# Altium project 1kW_BLDC_Controller.PrjPcb (part 1 of 2)
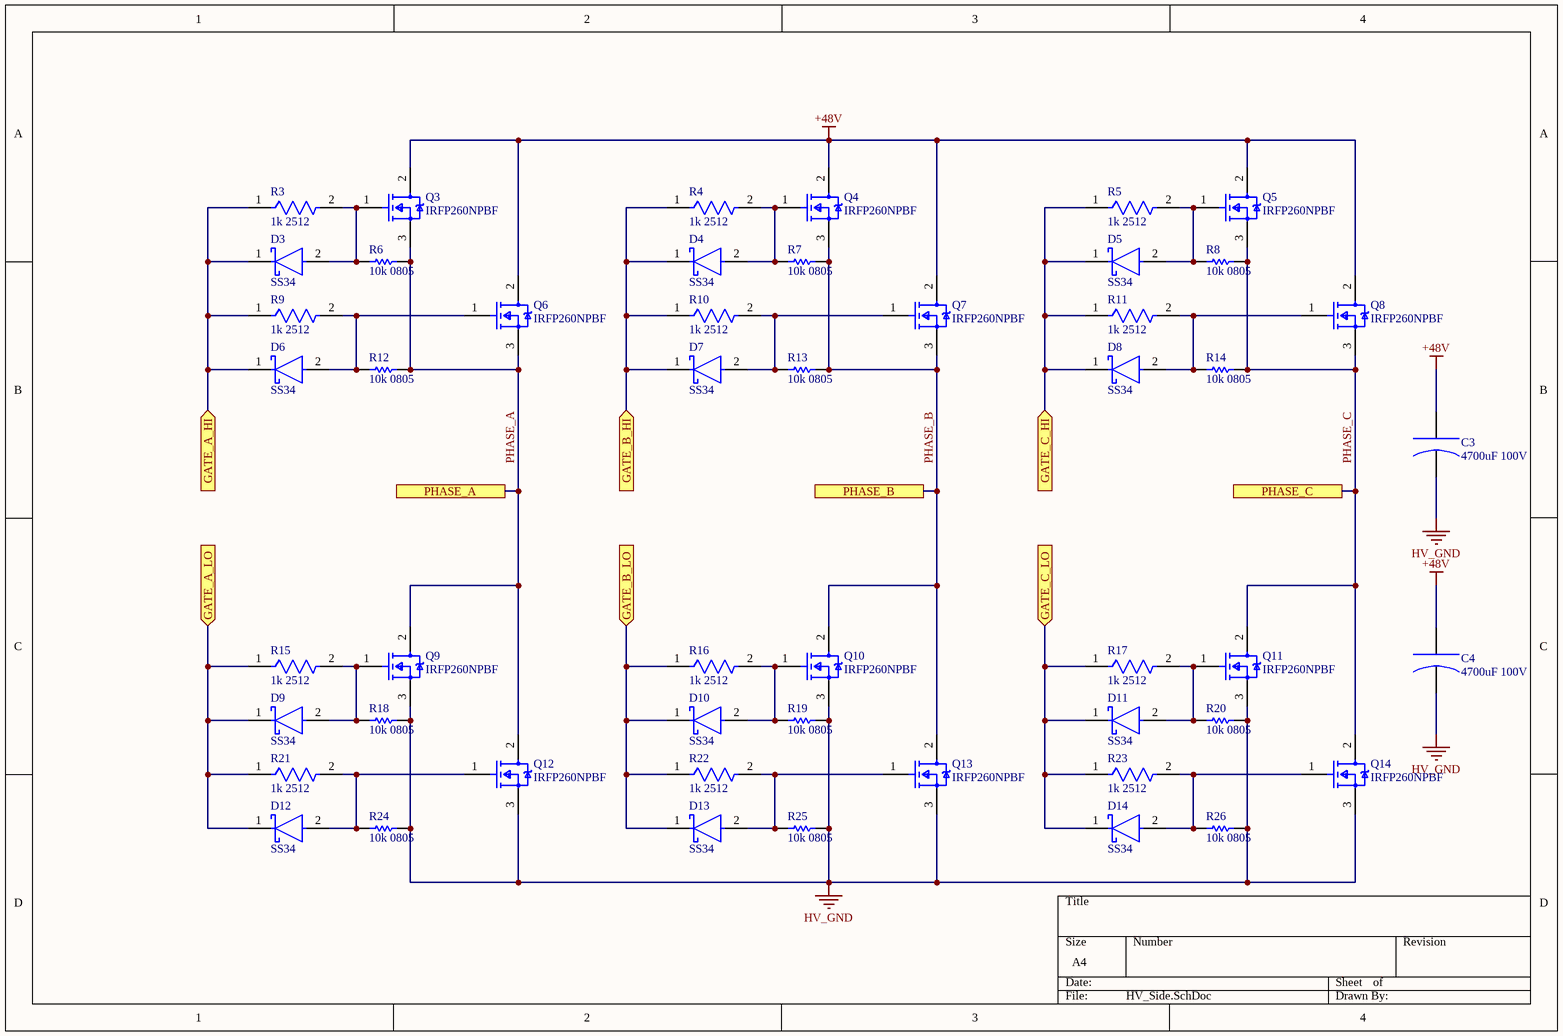
[diagram p0: HV_Side.SchDoc]
9 sheets, 236 parts. Net scope: global (net labels, ports and power ports of the same name join across sheets).
Board file: PCB1.PcbDoc
Sheets:
  HV_Side.SchDoc
  Gate_Driver.SchDoc
  Current_measurement.SchDoc
  Voltage_measurement.SchDoc
  Optocouplers.SchDoc
  optocouplers2.SchDoc
  Precharge circuit.SchDoc
  mcu.SchDoc
  stm32.SchDoc

## Sheet HV_Side.SchDoc
size A4; SheetNumber: 1; SheetTotal: 9

### Parts
C3  4700uF 100V  [4700uF 100V]
C4  4700uF 100V  [4700uF 100V]
D3  SS34  [DO-214AC]
D4  SS34  [DO-214AC]
D5  SS34  [DO-214AC]
D6  SS34  [DO-214AC]
D7  SS34  [DO-214AC]
D8  SS34  [DO-214AC]
D9  SS34  [DO-214AC]
D10  SS34  [DO-214AC]
D11  SS34  [DO-214AC]
D12  SS34  [DO-214AC]
D13  SS34  [DO-214AC]
D14  SS34  [DO-214AC]
Q3  IRFP260NPBF  [FP-PG-TO247-3-MFG]
Q4  IRFP260NPBF  [FP-PG-TO247-3-MFG]
Q5  IRFP260NPBF  [FP-PG-TO247-3-MFG]
Q6  IRFP260NPBF  [FP-PG-TO247-3-MFG]
Q7  IRFP260NPBF  [FP-PG-TO247-3-MFG]
Q8  IRFP260NPBF  [FP-PG-TO247-3-MFG]
Q9  IRFP260NPBF  [FP-PG-TO247-3-MFG]
Q10  IRFP260NPBF  [FP-PG-TO247-3-MFG]
Q11  IRFP260NPBF  [FP-PG-TO247-3-MFG]
Q12  IRFP260NPBF  [FP-PG-TO247-3-MFG]
Q13  IRFP260NPBF  [FP-PG-TO247-3-MFG]
Q14  IRFP260NPBF  [FP-PG-TO247-3-MFG]
R3  1k 2512  [R2512]
R4  1k 2512  [R2512]
R5  1k 2512  [R2512]
R6  10k 0805  [R0805]
R7  10k 0805  [R0805]
R8  10k 0805  [R0805]
R9  1k 2512  [R2512]
R10  1k 2512  [R2512]
R11  1k 2512  [R2512]
R12  10k 0805  [R0805]
R13  10k 0805  [R0805]
R14  10k 0805  [R0805]
R15  1k 2512  [R2512]
R16  1k 2512  [R2512]
R17  1k 2512  [R2512]
R18  10k 0805  [R0805]
R19  10k 0805  [R0805]
R20  10k 0805  [R0805]
R21  1k 2512  [R2512]
R22  1k 2512  [R2512]
R23  1k 2512  [R2512]
R24  10k 0805  [R0805]
R25  10k 0805  [R0805]
R26  10k 0805  [R0805]

### Ports
GATE_A_HI (in), GATE_A_LO (in), GATE_B_HI (in), GATE_B_LO (in), GATE_C_HI (in), GATE_C_LO (in), PHASE_A, PHASE_B, PHASE_C

### Nets
+48V: C3.1(+) C4.1(+) Q3.2(D) Q4.2(D) Q5.2(D) Q6.2(D) Q7.2(D) Q8.2(D)
HV_GND: C3.2(GND) C4.2(GND) Q9.3(S) Q10.3(S) Q11.3(S) Q12.3(S) Q13.3(S) Q14.3(S) R18.2 R19.2 R20.2 R24.2 R25.2 R26.2
PHASE_A: Q3.3(S) Q6.3(S) Q9.2(D) Q12.2(D) R6.2 R12.2 ; port PHASE_A
PHASE_B: Q4.3(S) Q7.3(S) Q10.2(D) Q13.2(D) R7.2 R13.2 ; port PHASE_B
PHASE_C: Q5.3(S) Q8.3(S) Q11.2(D) Q14.2(D) R8.2 R14.2 ; port PHASE_C
NetD3_1: D3.1(C) D6.1(C) R3.1 R9.1 ; port GATE_A_HI
NetD3_2: D3.2(A) Q3.1(G) R3.2 R6.1
NetD4_1: D4.1(C) D7.1(C) R4.1 R10.1 ; port GATE_B_HI
NetD4_2: D4.2(A) Q4.1(G) R4.2 R7.1
NetD5_1: D5.1(C) D8.1(C) R5.1 R11.1 ; port GATE_C_HI
NetD5_2: D5.2(A) Q5.1(G) R5.2 R8.1
NetD6_2: D6.2(A) Q6.1(G) R9.2 R12.1
NetD7_2: D7.2(A) Q7.1(G) R10.2 R13.1
NetD8_2: D8.2(A) Q8.1(G) R11.2 R14.1
NetD9_1: D9.1(C) D12.1(C) R15.1 R21.1 ; port GATE_A_LO
NetD9_2: D9.2(A) Q9.1(G) R15.2 R18.1
NetD10_1: D10.1(C) D13.1(C) R16.1 R22.1 ; port GATE_B_LO
NetD10_2: D10.2(A) Q10.1(G) R16.2 R19.1
NetD11_1: D11.1(C) D14.1(C) R17.1 R23.1 ; port GATE_C_LO
NetD11_2: D11.2(A) Q11.1(G) R17.2 R20.1
NetD12_2: D12.2(A) Q12.1(G) R21.2 R24.1
NetD13_2: D13.2(A) Q13.1(G) R22.2 R25.1
NetD14_2: D14.2(A) Q14.1(G) R23.2 R26.1

### Library data of the parts
C3 C4 = 4700uF 100V: 4700uF 100V Electrolytic Capacitor; Price per piece: 185; ComponentLink1Description: Product URL; ComponentLink1URL: https://sharvielectronics.com/product/4700uf-100v-electrolytic-capacitor/; ComponentLink2Description: Datasheet; ComponentLink2URL: *
D3-D14 = SS34: SS34 SMA 40V/3A Schottky Diode SMD Package-DO-214AC; Manufacturer: Vishay Semiconductors; Manufacturer Part Number: SS34-E3/57T; Max Repetitive Reverse Voltage: 40V; Max Junction Temp: +150°C; Forward Current: 3A; Peak Reverse Current: 0.5mA; Max Surge Forward Current: 100A; Standoff Height: 0mm; ComponentLink2Description: Datasheet; Device Class L3: Schottky Diodes; Height: 2.62mm; Lead Free: Yes; Package: 95402; Temperature Range High: +150°C; ComponentLink2URL: http://www.vishay.com/docs/88751/ss32.pdf; Temperature: -55°C to +150°C; Footprint Url: http://www.vishay.com/docs/95402/smc.pdf; Automotive: No; Category: Diode; RoHS: TRUE; Device Class L2: Diodes; Mouser Description: Schottky Diodes & Rectifiers 3.0 Amp 40 Volt; Octopart: https://octopart.com/ss34-e3%2F57t-vishay-39552907; Temperature Range Low: -55°C; Device Class L1: Discrete Semiconductors; Digikey Description: DIODE SCHOTTKY 40V 3A DO214AB; Price per piece: 5.75; Product URL: https://sharvielectronics.com/product/ss34-sma-40v-3a-schottky-diode-smd-package-do-214ac/; Datasheet: https://drive.google.com/file/d/1NCTjjzsUDglehHYd-VxKcrmaXziByLRA/view?usp=sharing
Q3-Q14 = CMP-32901-000262-1: MOSFET N-CH 200V 50A TO247AC; Drain to Source Resistance: 40mR; Turn-On Delay Time: 17ns; Gate to Source Voltage (Vgs): 20V; Turn-Off Delay Time: 55ns; Max Power Dissipation: 300W; Element Configuration: Single; Input Capacitance: 4.057nF; Threshold Voltage: 4V; Width: 0.209inch; Max Operating Temperature: 175°C; Number of Pins: 3; Lead Free: Lead Free; Rds On Max: 40mR; Case/Package: TO-247; Continuous Drain Current (ID): 50A; Power Dissipation: 300W; RoHS Compliant: Yes; Min Operating Temperature: -55°C; Drain to Source Voltage (Vdss): 200V; Mount: Through Hole; REACH SVHC: No SVHC; Packaging: Bulk; Drain to Source Breakdown Voltage: 200V; Halogen Free: Not Halogen Free; Height: 0.799inch; Length: 0.625inch; Max Dual Supply Voltage: 200V; Price per piece: 110.36
  Q6: ComponentLink1Description: Product URL; ComponentLink1URL: https://sharvielectronics.com/product/irfp260npbf-mosfet-200v-50a-n-channel-power-mosfet-to-247-package/; ComponentLink2Description: Datasheet; ComponentLink2URL: https://drive.google.com/file/d/1_dknK1hQ3iHxK7SVbMXCD2-SqB7tXl_1/view?usp=sharing
R3-R5 R9-R11 R15-R17 R21-R23 = 1K_2512: 1K Ohm 1W Resistor 2512 Package; Manufacturer: Vishay Dale; Manufacturer Part Number: CRCW25121R00FKEG; Resistance: 1R; Tolerance: 1%; Voltage Rating: 500V; Temperature Coefficient: 100ppm/°C; Prie per piece: 3.25; Number of Terminations: 2; Packaging: Tape and Reel; Features: Automotive AEC-Q200; Military Standard: Not; Power Rating: 1W; Max Operating Temperature: 155°C; Number of Pins: 2; Radiation Hardening: No; Mount: Surface Mount; Height: 0.6mm; Max Power Dissipation: 1W; Case Code (Metric): 6432; Termination: SMD/SMT; REACH SVHC: No SVHC; Case/Package: 2512; Weight: 0.001429oz; Package Quantity: 2000; Composition: Thick Film; Voltage Rating (DC): 500V; Width: 0.124inch; Length: 6.3mm; Lead Free: Lead Free; Min Operating Temperature: -55°C; Contact Plating: Tin; Case Code (Imperial): 2512; Depth: 3.15mm; Price per piece: 3.25; ComponentLink1Description: Product URL; ComponentLink1URL: https://sharvielectronics.com/product/1k-ohm-1w-resistor-2512-package-pack-of-5/; ComponentLink2Description: Datasheet; ComponentLink2URL: *; Product URL: https://sharvielectronics.com/product/1k-ohm-1w-resistor-2512-package-pack-of-5/; Datasheet: *
R6-R8 R12-R14 R18-R20 R24-R26 = 10k 0805: 10K Ohm 1/8 Watt Resistor 1% Tolerance RC0805FR-0710KL – 0805 Package; Price per piece: 0.82; Product URL: https://sharvielectronics.com/product/10k-ohm-1-8-watt-resistor-1-tolerance-rc0805fr-0710kl-0805-package/; Datasheet: https://drive.google.com/file/d/1pkLQT_RQ1i35oFQcGREpZr7Oy3Ppi-ZT/view?usp=sharing

## Sheet Gate_Driver.SchDoc
size A4; SheetNumber: 2; SheetTotal: 9; SPICEModelCacheSDNXEFHK: <root> / <DocumentId>SDNXEFHK</DocumentId> / <CacheFrame Number="0"> / <Model Name="jmk325ac6107_m-p" Kind="CKT"> / <Text>* JMK325AC6107_M-P     SPICE MODEL  ( General Type ) / *-------------------------------------------------------------------------------------------------------- / * Model Generated by TAIYO YUDEN Corporation (http://www.ty-top.com) / * Version 1.0 / * TAIYO YUDEN Control No. 180521 / *-------------------------------------------------------------------------------------------------------- / * / * Products Name : Multilayer Ceramic Capacitors / * / * Characteristics : / *     Capacitance : 100 uF , Rated Voltage : 6.3V , TCC : X6S / *     Case Size : 3.2 x 2.5 / 0.126 x 0.098 [mm/inch] , Thickness : 2.5 / 0.098 [mm/inch] / *     (Conditions: Temperature = 25 degC , DC Bias Current/Voltage = 0A / 0V) / * / * Frequency Range : 0.0001MHz - 3000MHz / * / * External Node Assignments : / * / *  1  o---| |---o  2 / * / *-------------------------------------------------------------------------------------------------------- / .SubCkt JMK325AC6107_M-P 1 2 / **************************** / C0 1 110 84.041u / Cm 1 101 6.4542u / C1 101 102 23.925u / Rc1 101 102 26.91 / C2 102 103 22.738u / Rc2 102 103 11.611 / C3 103 110 14.771u / Rc3 103 110 1.1701 / C2m 1 301 2.8348u / C21 301 302 86.426u / Rc21 301 302 122.56 / C22 302 303 42.078u / Rc22 302 303 54.419 / C23 303 304 18.473u / Rc23 303 304 45.467 / C24 304 305 15.24u / Rc24 304 305 25.43 / C25 305 306 12.218u / Rc25 305 306 14.511 / C26 306 307 8.9602u / Rc26 306 307 7.3048 / C27 307 308 6.4396u / Rc27 307 308 4.0856 / C28 308 309 3.5418u / Rc28 308 309 2.2851 / C29 309 110 1.4287u / Rc29 309 110 1.8837 / Rp0 1 110 1Meg / L0 110 120 0.1837n / Lm 120 130 0.44285n / L1 120 121 0.3007n / RL1 121 130 0.18029 / L2 120 122 0.60464n / RL2 122 130 69.963m / L3 120 123 0.74938n / RL3 123 130 2.1757 / CR 120 124 19.095u / LR 124 125 0.53061n / RR 125 130 10.898m / CL 130 140 8.9181p / LL 130 140 0.18335n / RL 130 140 6.5197 / Rs 140 2 1.3136m / **************************** / .ends</Text> / </Model> / </CacheFrame> / </root>
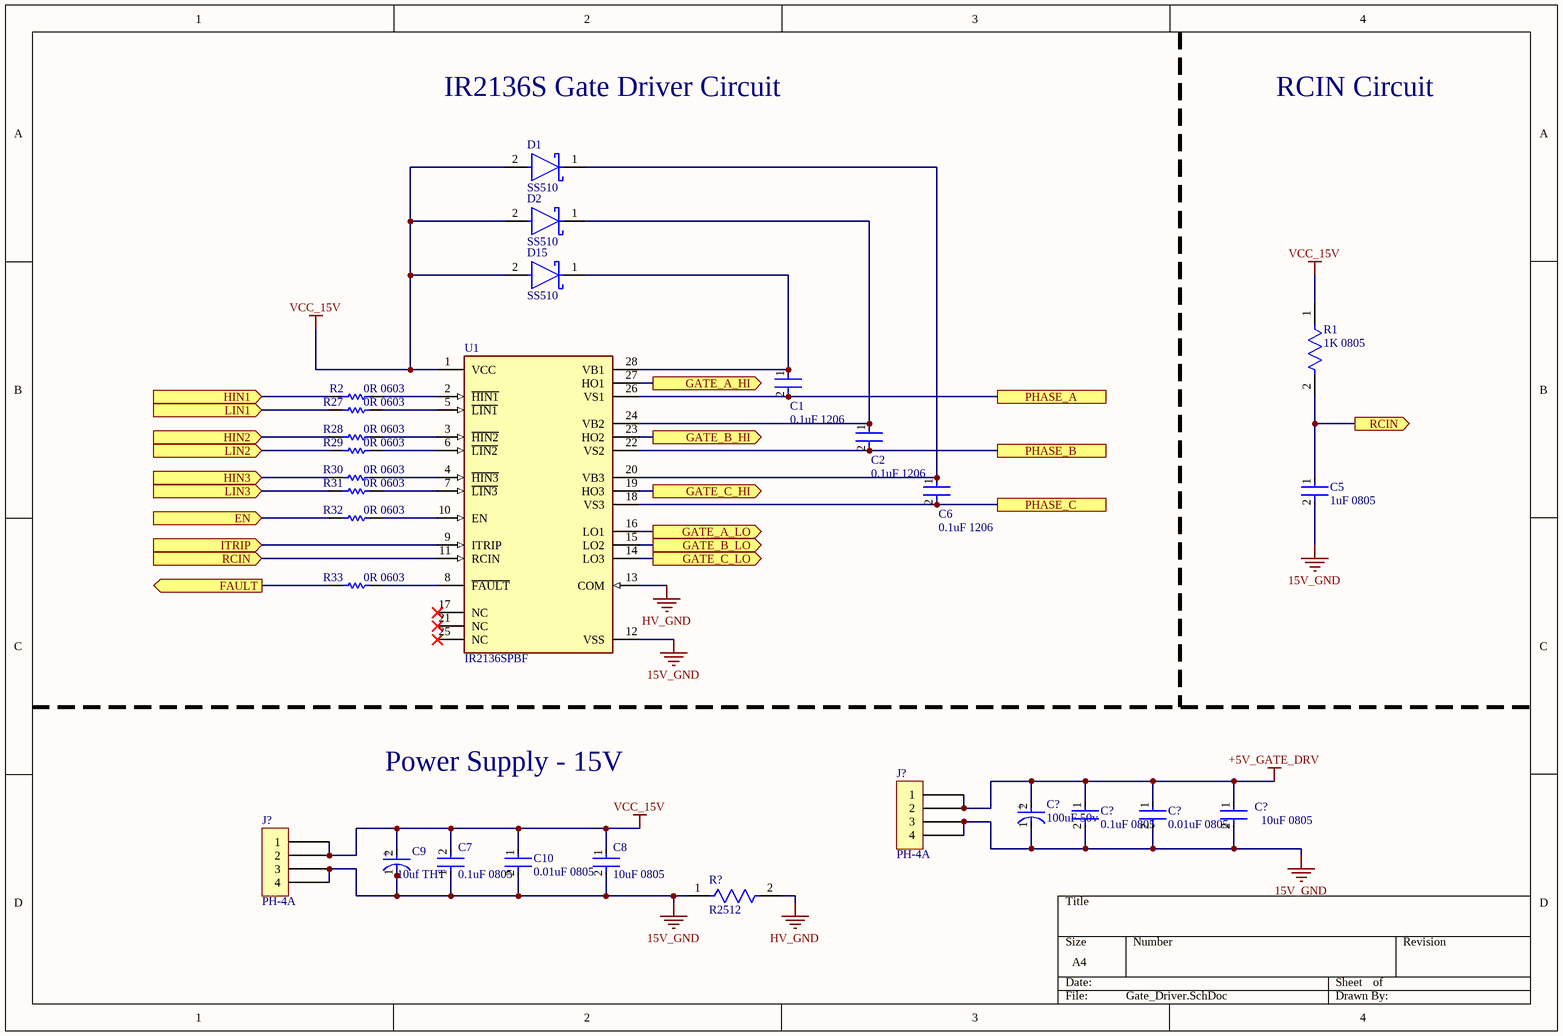
[diagram p1: Gate_Driver.SchDoc]

### Parts
(Parts that share a designator on the sheet are numbered #1, #2 ... from top to bottom, then left to right.)
C1  0.1uF 1206  [C1206]
C2  0.1uF 1206  [C1206]
C5  1uF 0805  [R0805]
C6  0.1uF 1206  [C1206]
C7  0.1uF 0805  [R0805]
C8  10uF 0805  [R0805]
C9  10uf THT  [FP-RAD-TH-D_10_0_5-L_20_2-MFG]
C10  0.01uF 0805  [R0805]
C?#1  100uF 50v  [FP-EEU-FR1H101B-MFG]
C?#2  0.1uF 0805  [R0805]
C?#3  0.01uF 0805  [R0805]
C?#4  10uF 0805  [R0805]
D1  SS510  [DO-210AA]
D2  SS510  [DO-210AA]
D15  SS510  [DO-210AA]
J?#1  PH-4A  [JST PH-4A]
J?#2  PH-4A  [JST PH-4A]
R1  1K 0805  [R0805]
R2  0R 0603  [R0603]
R27  0R 0603  [R0603]
R28  0R 0603  [R0603]
R29  0R 0603  [R0603]
R30  0R 0603  [R0603]
R31  0R 0603  [R0603]
R32  0R 0603  [R0603]
R33  0R 0603  [R0603]
R?#1  R2512  [R2512]
U1  IR2136SPBF  [FP-PG-DSO-28-IPC_C]

### Ports
EN (in), FAULT (out), GATE_A_HI (out), GATE_A_LO (out), GATE_B_HI (out), GATE_B_LO (out), GATE_C_HI (out), GATE_C_LO (out), HIN1 (in), HIN2 (in), HIN3 (in), ITRIP (in), LIN1 (in), LIN2 (in), LIN3 (in), PHASE_A, PHASE_B, PHASE_C, RCIN (in), RCIN (out)

### Nets
15V_GND: C5.2 C7.1 C8.2 C9.1(C) C10.2 C?#1.1(C) C?#2.2 C?#3.2 C?#4.2 J?#1.3 J?#1.4 J?#2.3 J?#2.4 R?#1.1 U1.12(VSS)
+5V_GATE_DRV: C?#1.2(A) C?#2.1 C?#3.1 C?#4.1 J?#1.1 J?#1.2
HV_GND: R?#1.2 U1.13(COM)
VCC_15V: C7.2 C8.1 C9.2(A) C10.1 D1.2(A) D2.2(A) D15.2(A) J?#2.1 J?#2.2 R1.1 U1.1(VCC)
PHASE_A: C1.2 U1.26(VS1) ; port PHASE_A
PHASE_B: C2.2 U1.22(VS2) ; port PHASE_B
PHASE_C: C6.2 U1.18(VS3) ; port PHASE_C
NetC1_1: C1.1 D15.1(C) U1.28(VB1)
NetC2_1: C2.1 D2.1(C) U1.24(VB2)
NetC5_1: C5.1 R1.2 U1.11(RCIN) ; port RCIN
NetC6_1: C6.1 D1.1(C) U1.20(VB3)
NetD3_1: U1.27(HO1) ; port GATE_A_HI
NetD4_1: U1.23(HO2) ; port GATE_B_HI
NetD5_1: U1.19(HO3) ; port GATE_C_HI
NetD9_1: U1.16(LO1) ; port GATE_A_LO
NetD10_1: U1.15(LO2) ; port GATE_B_LO
NetD11_1: U1.14(LO3) ; port GATE_C_LO
NetQ16_6: R2.1 ; port HIN1
NetQ17_6: R27.1 ; port LIN1
NetQ18_6: R28.1 ; port HIN2
NetQ19_6: R29.1 ; port LIN2
NetQ20_6: R30.1 ; port HIN3
NetQ21_6: R31.1 ; port LIN3
NetQ?#1_3: U1.9(ITRIP) ; port ITRIP
NetR2_2: R2.2 U1.2(~{HIN1})
NetR27_2: R27.2 U1.5(~{LIN1})
NetR28_2: R28.2 U1.3(~{HIN2})
NetR29_2: R29.2 U1.6(~{LIN2})
NetR30_2: R30.2 U1.4(~{HIN3})
NetR31_2: R31.2 U1.7(~{LIN3})
NetR32_1: R32.1 ; port EN
NetR32_2: R32.2 U1.10(EN)
NetR33_1: R33.1 ; port FAULT
NetR33_2: R33.2 U1.8(~{FAULT})

Not connected (* = marked no-connect by the designer): U1 17(NC)* 21(NC)* 25(NC)*

### Notes on the sheet
- IR2136S Gate Driver Circuit
- RCIN Circuit
- Power Supply - 15V
- (in symbol CMP-05427-000020-1) +
- (in symbol CMP-05427-000384-1) +

### Library data of the parts
C1 C2 C6 = 0.1uF 1206: 0.1uF/100nF 50V Capacitor ±10% Tolerance CC1206KRX7R9BB104 – 1206 Package; Price per piece: 2.22; Product URL: https://sharvielectronics.com/product/0-1uf-100nf-50v-capacitor-%c2%b110-tolerance-cc1206krx7r9bb104-1206-package/; Datasheet: https://sharvielectronics.com/wp-content/uploads/2020/09/Yageo-smd-Capacitor.pdf
C5 = 1uF 0805: 1uF/1000nF 50V Capacitor ±10% Tolerance CC0805KKX7R9BB105 – 0805 Package; Price per piece: 2.16; Product URL: https://sharvielectronics.com/product/1uf-1000nf-50v-capacitor-%c2%b110-tolerance-cc0805kkx7r9bb105-0805-package/; Datasheet: https://drive.google.com/file/d/1wr2K_YaGqgMtACeU2pC6RWLSxDMrIPxr/view?usp=sharing
C7 C?#2 = 0.1uF 0805: 0.1uF/100nF 100V Capacitor ±10% Tolerance CC0805KKX7R0BB104 – 0805 Package; Product URL: https://sharvielectronics.com/product/0-1uf-100nf-100v-capacitor-%c2%b110-tolerance-cc0805kkx7r0bb104-0805-package/; Price per piece: 4.76; Datasheet: https://drive.google.com/file/d/1wr2K_YaGqgMtACeU2pC6RWLSxDMrIPxr/view?usp=sharing
C8 C?#4 = 10uF 0805: 10uF/1000nF 50V Capacitor ±10% Tolerance CC0805KKX5R9BB106 – 0805 Package; Product URL: https://sharvielectronics.com/product/10uf-1000nf-50v-capacitor-%c2%b110-tolerance-cc0805kkx5r9bb106-0805-package/; Price per piece: 2.85; Datasheet: https://drive.google.com/file/d/1wr2K_YaGqgMtACeU2pC6RWLSxDMrIPxr/view?usp=sharing
C9 = CMP-05427-000384-1: Aluminum Electrolytic Capacitors (Radial Lead Type) 10uF ±20% 350V; Lead/Base Style: Straight; Lead Diameter: 0.6mm; Ripple Current (AC): 82mA; Life (Hours): 2000Hour; Series: NHG; Packaging: Bulk; Case/Package: Radial; Contact Plating: Tin; Voltage Rating: 350V; Tolerance: 20%; Termination: Radial; Lead Pitch: 5mm; Max Operating Temperature: 105°C; REACH SVHC: No SVHC; Height - Seated (Max): 0.866inch; Radiation Hardening: No; Voltage Rating (DC): 350V; Diameter: 10mm; Length: 20mm; Mount: Through Hole; Package Quantity: 200; Min Operating Temperature: -25°C; Construction: RADIAL; Ripple Current: 82mA; Height: 20mm; Capacitance: 10uF; RoHS Compliant: Yes; Price per piece: 2.25; Product URL: https://sharvielectronics.com/product/10uf-35v-electrolytic-capacitor-105c-5x11mm-samwha/; Datasheet: https://drive.google.com/file/d/1s8SUY3P6K0bBIcG8WC2zo0Wz7jUZ4bD_/view?usp=sharing
C10 C?#3 = 0.01uF 0805: 10nF/0.01uF 50V Capacitor ±10% Tolerance 0805B103K500CT – 0805 Package; Product URL: https://sharvielectronics.com/product/10nf-0-01uf-50v-capacitor-%c2%b110-tolerance-0805b103k500ct-0805-package/; Price per piece: 2.45; Datasheet: https://drive.google.com/file/d/18RHnvRuuuVekgJyOA4l8O3UUaSpuKbHR/view?usp=sharing
C?#1 = CMP-05427-000020-1: 100uF 50V Electrolytic Capacitor – JWCO; Tolerance: 20%; Life (Hours): 6000Hour; Ripple Current: 870mA; Lead Diameter: 0.6mm; Impedance: 61mR; Mount: Through Hole; Lead Free: Lead Free; Length: 11.5mm; Height - Seated (Max): 0.512inch; Contact Plating: Tin; Termination: Radial; Series: FR; Max Operating Temperature: 105°C; Features: General Purpose; Min Operating Temperature: -40°C; RoHS Compliant: Yes; Height: 11.5mm; Voltage Rating (DC): 50V; Diameter: 8mm; Capacitance: 100uF; Lead Pitch: 5mm; Radiation Hardening: No; Package Quantity: 1; Case/Package: Radial; Voltage Rating: 50V; Packaging: Tape and Reel; ESR (Equivalent Series Resistance): 61mR; REACH SVHC: No SVHC; Price per piece: 4.75; Product URL: https://sharvielectronics.com/product/100uf-50v-electrolytic-capacitor-jwco/; Datasheet: https://drive.google.com/file/d/1y5PJPaMvWZ3P4wiieSg8-_Hf04MAZeNc/view?usp=sharing
D1 D2 D15 = SS510: SS510-E3/52T – 100V 5A High Voltage Schottky Diode – DO-214AA Package; Product URL: https://sharvielectronics.com/product/ss510-e3-52t-100v-5a-high-voltage-schottky-diode-do-214aa-package/; Datasheet: https://drive.google.com/file/d/1iz5AYn44Er0kaCDKeIane-7fZ44xILG8/view?usp=sharing; Price per piece: 12.75
J?#1 J?#2 = 4 Pin JST PH-4A: 4 Pin JST PH-4A Straight Male Connector – 2mm Pitch; Price per piece: 3.55; Product URL: https://sharvielectronics.com/product/4-pin-jst-ph-4a-straight-male-connector-2mm-pitch/; Datasheet: https://drive.google.com/file/d/1xtnH8dmm313gQd5L_EWqAXCnKwT4okMA/view?usp=sharing
R1 = 1k 0805: 1K Ohm 1/8 Watt Resistor 1% Tolerance 0805S8F1001T5E – 0805 Package; Price per piece: 0.82; Product URL: https://sharvielectronics.com/product/1k-ohm-1-8-watt-resistor-1-tolerance-0805s8f1001t5e-0805-package/; Datasheet: https://drive.google.com/file/d/1rtx85iFJaMrDbsv7PAzG9bTFItPmAE38/view?usp=sharing
R2 R27-R33 = R0000 0603: 0 Ohm 1/10 Watt Resistor 1% Tolerance RC0603FR-070RL – 0603 Package; Price per piece: 0.97; Product URL: https://sharvielectronics.com/product/0-ohm-1-10-watt-resistor-1-tolerance-rc0603fr-070rl-0603-package/; Datasheet: https://drive.google.com/file/d/1pkLQT_RQ1i35oFQcGREpZr7Oy3Ppi-ZT/view?usp=sharing
R?#1 = 1K_2512: as R3 on sheet HV_Side; Number of Terminations: 2; Packaging: Tape and Reel; Features: Automotive AEC-Q200; Military Standard: Not; Power Rating: 1W; Max Operating Temperature: 155°C; Number of Pins: 2; Radiation Hardening: No; Mount: Surface Mount; Height: 0.6mm; Max Power Dissipation: 1W; Case Code (Metric): 6432; Termination: SMD/SMT; REACH SVHC: No SVHC; Case/Package: 2512; Weight: 0.001429oz; Package Quantity: 2000; Composition: Thick Film; Voltage Rating (DC): 500V; Width: 0.124inch; Length: 6.3mm; Lead Free: Lead Free; Min Operating Temperature: -55°C; Contact Plating: Tin; Case Code (Imperial): 2512; Depth: 3.15mm; Price per piece: 3.25; ComponentLink1Description: Product URL; ComponentLink1URL: https://sharvielectronics.com/product/1k-ohm-1w-resistor-2512-package-pack-of-5/; ComponentLink2Description: Datasheet; ComponentLink2URL: *; Product URL: https://sharvielectronics.com/product/1k-ohm-1w-resistor-2512-package-pack-of-5/; Datasheet: *
U1 = CMP-32851-000132-1: IC GATE DRVR HALF-BRIDGE 28SOIC; Fall Time: 75ns; Max Supply Voltage: 20V; On-State Resistance: 100R; Output Voltage: 620V; Number of Drivers: 6; Max Output Current: 350mA; Propagation Delay: 425ns; Channel Type: 3-Phase; Min Supply Voltage: 10V; Halogen Free: Halogen Free; Height: 0.093inch; REACH SVHC: No SVHC; RoHS Compliant: Yes; Case/Package: SOIC; Number of Channels: 6; Lead Free: Lead Free; Output Current: 350mA; Number of Outputs: 6; Mount: Surface Mount; Packaging: Rail/Tube; Min Operating Temperature: -40°C; Package Quantity: 25; Series: -; Max Operating Temperature: 150°C; Width: 0.299inch; Length: 0.712inch; Number of Pins: 28; Price per piece: 365; ComponentLink1Description: New link; ComponentLink1URL: *; Product URL: https://sharvielectronics.com/product/ir2136-3-phase-bridge-driver/

## Sheet Current_measurement.SchDoc
size A4; SheetNumber: 3; SheetTotal: 9; SPICEModelCacheJBRCZOZI: <root> / <DocumentId>JBRCZOZI</DocumentId> / <CacheFrame Number="0"> / <Model Name="mcp6001" Kind="CKT"> / <Text>.SUBCKT MCP6001 1 2 3 4 5 / *               | | | | | / *               | | | | Output / *               | | | Negative Supply / *               | | Positive Supply / *               | Inverting Input / *               Non-inverting Input / * / ******************************************************************************** / * Software License Agreement                                                   * / *                                                                              * / * The software supplied herewith by Microchip Technology Incorporated (the     * / * "Company") is intended and supplied to you, the Company's customer, for use  * / * soley and exclusively on Microchip products.                                 * / *                                                                              * / * The software is owned by the Company and/or its supplier, and is protected   * / * under applicable copyright laws. All rights are reserved. Any use in         * / * violation of the foregoing restrictions may subject the user to criminal     * / * sanctions under applicable laws, as well as to civil liability for the       * / * breach of the terms and conditions of this license.                          * / *                                                                              * / * THIS SOFTWARE IS PROVIDED IN AN "AS IS" CONDITION. NO WARRANTIES, WHETHER    * / * EXPRESS, IMPLIED OR STATUTORY, INCLUDING, BUT NOT LIMITED TO, IMPLIED        * / * WARRANTIES OF MERCHANTABILITY AND FITNESS FOR A PARTICULAR PURPOSE APPLY TO  * / * THIS SOFTWARE. THE COMPANY SHALL NOT, IN ANY CIRCUMSTANCES, BE LIABLE FOR    * / * SPECIAL, INCIDENTAL OR CONSEQUENTIAL DAMAGES, FOR ANY REASON WHATSOEVER.     * / ******************************************************************************** / * / * Macromodel for the MCP6001/2/4 op amp family: / *   MCP6001, MCP6001R, MCP6001U, MCP6002, MCP6004 / * / * Revision History: / *   REV A: 21-Jun-02, Created model / *   REV B: 16-Jul-02, Improved output stage / *   REV C: 03-Jan-03, Added MCP6001 / *   REV D: 19-Aug-06, Added over temperature, improved output stage, / *                     fixed overdrive recovery time / *   REV E: 27-Jul-07, Updated output impedance for better model stability w/cap load / *   REV F: 09-Jul-12, Added MCP6001R, MCP6001U / * / * Recommendations: / *   Use PSPICE (other simulators may require translation) / *   For a quick, effective design, use a combination of: data sheet / *     specs, bench testing, and simulations with this macromodel / *   For high impedance circuits, set GMIN=100F in .OPTIONS / * / * Supported: / *   Typical performance for temperature range (-40 to 125) degrees Celsius / *   DC, AC, Transient, and Noise analyses. / *   Most specs, including: offsets, DC PSRR, DC CMRR, input impedance, / *     open loop gain, voltage ranges, supply current, ... , etc. / *   Temperature effects for Ibias, Iquiescent, Iout short circuit / *   current, Vsat on both rails, Slew Rate vs. Temp and P.S. / * / * Not Supported: / *   Some Variation in specs vs. Power Supply Voltage / *   Monte Carlo (Vos, Ib), Process variation / *   Distortion (detailed non-linear behavior) / *   Behavior outside normal operating region / * / * Input Stage / V10  3 10 -500M / R10 10 11 6.90K / R11 10 12 6.90K / C11 11 12 0.2p / C12 1  0 6.00P / E12 71 14 POLY(4) 20 0 21 0 26 0 27 0   1.00M 20.1 20.1 1 1 / G12 1 0 62 0 1m / M12 11 14 15 15 NMI L=2.00U W=42.0U / M14 12  2 15 15 NMI L=2.00U W=42.0U / G14 2 0 62 0 1m / C14  2  0 6.00P / I15 15  4 50.0U / V16 16  4 -300M / GD16 16 1 TABLE {V(16,1)} ((-100,-1p)(0,0)(1m,1n)(2m,1m)(3m,1)) / V13  3 13 -300M / GD13 2 13 TABLE {V(2,13)} ((-100,-1p)(0,0)(1m,1n)(2m,1m)(3m,1)) / R70 1 0 20.6T / R71 2 0 20.6T / R72 1 2 20T / I80 1 2 0.5p / * / * Noise, PSRR, and CMRR / I20 21 20 423U / D20 20  0 DN1 / D21  0 21 DN1 / G26  0 26 POLY(1) 3 4   110U -49U / R26 26  0 1 / G27  0 27 POLY(2) 1 0 2 0   -440U 39.7U 39.7U / R27 27  0 1 / * / * Open Loop Gain, Slew Rate / G30  0 30 POLY(1) 12 11   0 1 / R30 30  0 1K / G31  0 31 POLY(1) 3 4 86 5.25 / R31 31  0 1 TC=2.8m / GD31 30 31 TABLE {V(30,31)} ((-11,-1)(-10,-10n)(0,0)(1m,1000)) / G32 32  0 POLY(1) 3 4 113.7 3.5 / R32 32  0 1 TC=2.65m / GD32 30 32 TABLE {V(30,32)} ((-1m,-1000)(0,0)(10,10n)(11,1)) / G33 0 33 30 0 1m / R33 33 0 1k / G34  0 34 33 0 425M / R34  34 0 1K / C34  34 0 74U / G37  0 37 34 0 1m / R37  37 0 1K / C37  37 0 41.6P / G38  0 38 37 0 1m / R38  39 0 1K / L38  38 39 100U / E38  35 0 38 0 1 / G35 33 0 TABLE {V(35,3)} ((-1,-1n)(0,0)(16,1n))(16.1,1)) / G36 33 0 TABLE {V(35,4)} ((-16.1,-1)((-16,-1n)(0,0)(1,1n)) / * / * Output Stage / R80 50 0 100MEG / G50 0 50 57 96 2 / R58 57  96 0.50 / R57 57  0 750 / C58  5  0 2.00P / G57  0 57 POLY(3) 3 0 4 0 35 0   0 0.67M 0.67M 1.5M / GD55 55 57 TABLE {V(55,57)} ((-2m,-1)(-1m,-1m)(0,0)(10,1n)) / GD56 57 56 TABLE {V(57,56)} ((-2m,-1)(-1m,-1m)(0,0)(10,1n)) / E55 55  0 POLY(2) 3 0 51 0 -0.7m 1 -40.0M / E56 56  0 POLY(2) 4 0 52 0 1.2m 1 -37.0M / R51 51 0 1k / R52 52 0 1k / GD51 50 51 TABLE {V(50,51)} ((-10,-1n)(0,0)(1m,1m)(2m,1)) / GD52 50 52 TABLE {V(50,52)} ((-2m,-1)(-1m,-1m)(0,0)(10,1n)) / G53  3  0 POLY(1) 51 0  -49U 1M / G54  0  4 POLY(1) 52 0  -49U -1M / * / * Current Limit / G99 96 5 99 0 1 / R98 0 98 1 TC=-2.8M,2.63U / G97 0 98 TABLE { V(96,5) } ((-11.0,-10.0M)(-1.00M,-9.9M)(0,0)(1.00M,9.9M)(11.0,10.0M)) / E97 99 0 VALUE { V(98)*((V(3)-V(4))*359M + 310M)} / D98 4 5 DESD / D99 5 3 DESD / * / * Temperature / Voltage Sensitive IQuiscent / R61 0 61 100 TC 3.11M 4.51U / G61 3 4 61 0 1 / G60 0 61 TABLE {V(3, 4)} / + ((0,0)(900M,0.0106U)(1.00,0.20U)(1.3,0.63U) / + (1.5,0.66U)(1.6,1.06U)(5.5,1.10U)) / * / * Temp Sensitive offset voltage / I73 0 70 DC 1uA / R74 0 70 1 TC=2 / E75 1 71 70 0 1 / * / * Temp Sensistive IBias / I62 0 62 DC 1uA / R62 0 62 REXP 58.2u / * Voltage on R62 used for G12, G14 in input stage / * / * Models / .MODEL NMI NMOS / .MODEL DESD  D   N=1 IS=1.00E-15 / .MODEL DL  D   N=1 IS=1F / .MODEL DN1 D   IS=1P KF=146E-18 AF=1 / .MODEL REXP RES TCE=10.1 / .ENDS MCP6001</Text> / </Model> / <Model Name="smk316b7103_f-t" Kind="CKT"> / <Text>* SMK316B7103_F-T     SPICE MODEL  ( General Type ) / *-------------------------------------------------------------------------------------------------------- / * Model Generated by TAIYO YUDEN Corporation (http://www.ty-top.com) / * Version 1.0 / * TAIYO YUDEN Control No. 170508_161201 / * Copyright(c) 2012 TAIYO YUDEN CO.,LTD. All Rights Reserved. / *-------------------------------------------------------------------------------------------------------- / * / * Products Name : Multilayer Ceramic Capacitors / * / * Characteristics : / *     Capacitance : 0.01 uF , Rated Voltage : 630V , TCC : X7R / *     Case Size : 3.2 x 1.6 / 0.126 x 0.063 [mm/inch] , Thickness : 1.15 / 0.045 [mm/inch] / *     (Conditions: Temperature = 25 degC , DC Bias Current/Voltage = 0A / 0V) / * / * Frequency Range : 40Hz - 3GHz / * / * External Node Assignments : / * / *  1  o---| |---o  2 / * / *-------------------------------------------------------------------------------------------------------- / .SubCkt SMK316B7103_F-T 1 2 / **************************** / C0 1 110 9888p / Cm 1 101 398.4p / C1 101 102 1923.4p / Rc1 101 102 288.22k / C2 102 103 1016.2p / Rc2 102 103 14.114k / C3 103 110 4.0985p / Rc3 103 110 430.45 / C2m 1 301 429.64p / C21 301 302 0.05831u / Rc21 301 302 274.72k / C22 302 303 5474.8p / Rc22 302 303 613.52k / C23 303 304 3415.7p / Rc23 303 304 754.71k / C24 304 305 2829.6p / Rc24 304 305 45.094k / C25 305 306 1811.9p / Rc25 305 306 41.061k / C26 306 307 1276.1p / Rc26 306 307 2.7245k / C27 307 308 180.55p / Rc27 307 308 2.1125k / C28 308 309 583.2p / Rc28 308 309 516.69 / C29 309 110 1.724p / Rc29 309 110 368.87 / Rp0 1 110 10G / L0 110 120 0.45307n / Lm 120 130 0.21245n / L1 120 121 3.2969p / RL1 121 130 33.569 / L2 120 122 0.53999n / RL2 122 130 0.49892 / L3 120 123 3.1666n / RL3 123 130 4.2853 / CR 120 124 1050.7p / LR 124 125 0.2527n / RR 125 130 0.40977 / CL 130 140 7.2948p / LL 130 140 0.31535n / RL 130 140 12.803 / Rs 140 2 57.335m / **************************** / .ends SMK316B7103_F-T</Text> / </Model> / <Model Name="qmk325bj104_n-t" Kind="CKT"> / <Text>* QMK325BJ104_N-T     SPICE MODEL  ( General Type ) / *-------------------------------------------------------------------------------------------------------- / * Model Generated by TAIYO YUDEN Corporation (http://www.ty-top.com) / * Version 1.0 / * TAIYO YUDEN Control No. 170508_101215 / * Copyright(c) 2012 TAIYO YUDEN CO.,LTD. All Rights Reserved. / *-------------------------------------------------------------------------------------------------------- / * / * Products Name : Multilayer Ceramic Capacitors / * / * Characteristics : / *     Capacitance : 0.1 uF , Rated Voltage : 250V , TCC : B / X5R / *     Case Size : 3.2 x 2.5 / 0.126 x 0.098 [mm/inch] , Thickness : 1.9 / 0.075 [mm/inch] / *     (Conditions: Temperature = 25 degC , DC Bias Current/Voltage = 0A / 0V) / * / * Frequency Range : 40Hz - 3GHz / * / * External Node Assignments : / * / *  1  o---| |---o  2 / * / *-------------------------------------------------------------------------------------------------------- / .SubCkt QMK325BJ104_N-T 1 2 / **************************** / C0 1 110 0.09559u / Cm 1 101 3751.1p / C1 101 102 0.015822u / Rc1 101 102 51.629k / C2 102 103 7648.8p / Rc2 102 103 3.8642k / C3 103 110 450.5p / Rc3 103 110 113.97 / C2m 1 301 3919.2p / C21 301 302 0.035457u / Rc21 301 302 241.74k / C22 302 303 0.036825u / Rc22 302 303 156.05k / C23 303 304 0.038127u / Rc23 303 304 141.7k / C24 304 305 0.017837u / Rc24 304 305 8.8244k / C25 305 306 0.016301u / Rc25 305 306 9.1046k / C26 306 307 0.010066u / Rc26 306 307 717.43 / C27 307 308 1390.3p / Rc27 307 308 682.39 / C28 308 309 8928.6p / Rc28 308 309 84.912 / C29 309 110 13.208p / Rc29 309 110 119.07 / Rp0 1 110 1G / L0 110 120 0.24814n / Lm 120 130 0.27661n / RL1 120 130 181.88 / L2 120 122 0.76576n / RL2 122 130 0.73015 / L3 120 123 1.0444n / RL3 123 130 1.0157 / CR 120 124 0.022178u / LR 124 125 0.21869n / RR 125 130 0.15853 / CL 130 140 13.866p / LL 130 140 0.20298n / RL 130 140 8.1514 / Rs 140 2 13.921m / **************************** / .ends QMK325BJ104_N-T</Text> / </Model> / <Model Name="ntc_10k_1" Kind="CKT"> / <Text>.SUBCKT NTC_10K_1   1 2   4 5 / ETHERM 1 3 VALUE = { I(VSENSE)*10K*EXP( 3548/(V(4,5)+273) - 3548/(25+273) ) } / VSENSE 3 2 DC 0 / .ENDS</Text> / </Model> / </CacheFrame> / </root>
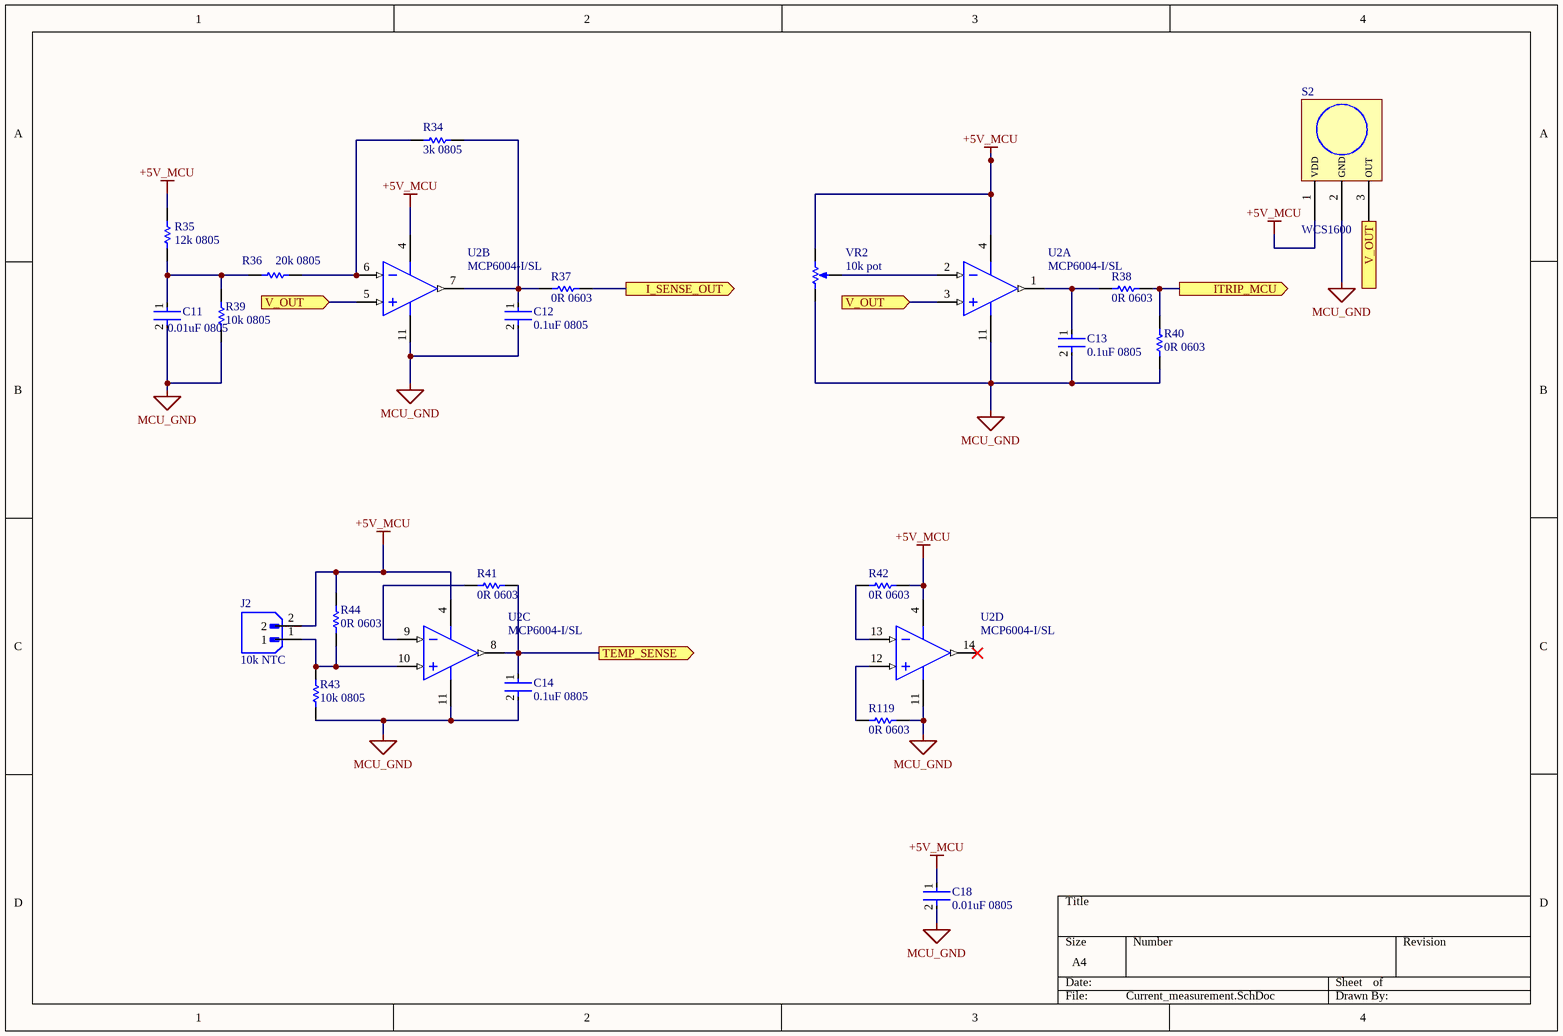
[diagram p2: Current_measurement.SchDoc]

### Parts
C11  0.01uF 0805  [R0805]
C12  0.1uF 0805  [R0805]
C13  0.1uF 0805  [R0805]
C14  0.1uF 0805  [R0805]
C18  0.01uF 0805  [R0805]
J2  10k NTC  [XH2.5-2p]
R34  3k 0805  [R0805]
R35  12k 0805  [R0805]
R36  20k 0805  [R0805]
R37  0R 0603  [R0603]
R38  0R 0603  [R0603]
R39  10k 0805  [R0805]
R40  0R 0603  [R0603]
R41  0R 0603  [R0603]
R42  0R 0603  [R0603]
R43  10k 0805  [R0805]
R44  0R 0603  [R0603]
R119  0R 0603  [R0603]
S2  WCS1600  [WCS1600]
U2  MCP6004-I/SL  [SOIC-SL14_M]  (parts A,B,C,D of 4)
VR2  10k pot  [BOUR-3299W-3_V]

### Ports
I_SENSE_OUT (out), ITRIP_MCU (out), TEMP_SENSE (out), V_OUT (in), V_OUT (out)

### Nets
+5V_MCU: C18.1 J2.2 R35.2 R42.2 R44.2 S2.1(VDD) U2.4(VDD) VR2.1(CCW)
MCU_GND: C11.2 C12.2 C13.2 C14.2 C18.2 R39.1 R40.1 R43.1 R119.2 S2.2(GND) U2.11(VSS) VR2.3(CW)  [project net A_GND]
NetC11_1: C11.1 R35.1 R36.1 R39.2
NetC12_1: C12.1 R34.2 R37.1 U2.7(VOUTB)
NetC13_1: C13.1 R38.1 U2.1(VOUTA)
NetC14_1: C14.1 R41.2 U2.8(VOUTC) ; port TEMP_SENSE
NetH8_41: R37.2 ; port I_SENSE_OUT
NetJ2_1: J2.1 R43.2 R44.1 U2.10(VINC+)
NetR34_1: R34.1 R36.2 U2.6(VINB-)
NetR38_2: R38.2 R40.2 ; port ITRIP_MCU
NetR41_1: R41.1 U2.9(VINC-)
NetR42_1: R42.1 U2.13(VIND-)
NetR119_1: R119.1 U2.12(VIND+)
NetS2_3: S2.3(OUT) U2.3(VINA+) U2.5(VINB+) ; port V_OUT
NetU2_2: U2.2(VINA-) VR2.2(WIPER)

Not connected (* = marked no-connect by the designer): U2 14(VOUTD)*

### Library data of the parts
C11 C18 = 0.01uF 0805: as C10 on sheet Gate_Driver; Product URL: https://sharvielectronics.com/product/10nf-0-01uf-50v-capacitor-%c2%b110-tolerance-0805b103k500ct-0805-package/; Price per piece: 2.45; Datasheet: https://drive.google.com/file/d/18RHnvRuuuVekgJyOA4l8O3UUaSpuKbHR/view?usp=sharing
C12-C14 = 0.1uF 0805: as C7 on sheet Gate_Driver; Product URL: https://sharvielectronics.com/product/0-1uf-100nf-100v-capacitor-%c2%b110-tolerance-cc0805kkx7r0bb104-0805-package/; Price per piece: 4.76; Datasheet: https://drive.google.com/file/d/1wr2K_YaGqgMtACeU2pC6RWLSxDMrIPxr/view?usp=sharing
J2 = XH2.5-2p: 2 Pin JST-XH Male Straight 2515 Connector 2.54mm Pitch; Price per piece: 1.65; Product URL: https://sharvielectronics.com/product/2-pin-jst-xh-male-straight-2515-connector-2-54mm-pitch/; Datasheet: https://sharvielectronics.com/wp-content/uploads/2021/01/XH-Connector.pdf
R34 = R0805: 3K Ohm 1/8 Watt Resistor 1% Tolerance 0805W8F3001T5E – 0805 Package; Price per piece: 0.82; Product URL: https://sharvielectronics.com/product/3k-ohm-1-8-watt-resistor-1-tolerance-0805w8f3001t5e-0805-package/; Datasheet: https://drive.google.com/file/d/1rtx85iFJaMrDbsv7PAzG9bTFItPmAE38/view?usp=sharing
R35 = R0805: 12K Ohm 1/8 Watt Resistor 1% Tolerance RC0805FR-0712KL – 0805 Package; Price per piece: 0.93; Product URL: https://sharvielectronics.com/product/12k-ohm-1-8-watt-resistor-1-tolerance-rc0805fr-0712kl-0805-package/; Datasheet: https://drive.google.com/file/d/1pkLQT_RQ1i35oFQcGREpZr7Oy3Ppi-ZT/view?usp=sharing
R36 = R0805: 20K ohm 1/8 Watt SMD Resistor 1% Tolerance RC0805FR-0720KL – 0805 Package; Price per piece: 1.15; Product URL: https://sharvielectronics.com/product/20k-ohm-1-8-watt-smd-resistor-1-tolerance-rc0805fr-0720kl-0805-package/; Datasheet: https://drive.google.com/file/d/1pkLQT_RQ1i35oFQcGREpZr7Oy3Ppi-ZT/view?usp=sharing
R37 R38 R40-R42 R44 R119 = R0000 0603: as R2 on sheet Gate_Driver; Price per piece: 0.97; Product URL: https://sharvielectronics.com/product/0-ohm-1-10-watt-resistor-1-tolerance-rc0603fr-070rl-0603-package/; Datasheet: https://drive.google.com/file/d/1pkLQT_RQ1i35oFQcGREpZr7Oy3Ppi-ZT/view?usp=sharing
R39 R43 = 10k 0805: as R6 on sheet HV_Side; Price per piece: 0.82; Product URL: https://sharvielectronics.com/product/10k-ohm-1-8-watt-resistor-1-tolerance-rc0805fr-0710kl-0805-package/; Datasheet: https://drive.google.com/file/d/1pkLQT_RQ1i35oFQcGREpZr7Oy3Ppi-ZT/view?usp=sharing
S2 = WCS1600: WCS1600 100A Hall Effect Linear Current Sensor; Price per piece: 280.67; Product URL: https://sharvielectronics.com/product/wcs1600-100a-hall-effect-linear-current-sensor/; Datasheet: https://sharvielectronics.com/wp-content/uploads/2020/02/WCS1600.pdf
U2 = CMP-0187-00321-3: MCP6004 1MHz Rail-to-Rail Operational Amplifier – SOIC-14 Package; Number of Channels: 4; Amplifier Type: GENERAL PURPOSE; Common Mode Rejection Ratio: 60dB; Voltage Gain: 112dB; Min Supply Voltage: 1.8V; Slew Rate-Nom: 0.6V/µs; Supply Current: 100uA; Input Offset Voltage-Max: 4.5mV; Power Supply Rejection Ratio (PSRR): 86dB; Output Current: 23mA; Operating Supply Voltage: 5.5V; Input Bias Current: 1pA; Max Supply Voltage: 6V; RoHS Compliant: Yes; Technology: CMOS; Radiation Hardening: No; Bandwidth: 1MHz; Number of Elements: 4; REACH SVHC: No SVHC; Number of Amplifiers: 4; Lead Free: Lead Free; Contact Plating: Tin; Max Operating Temperature: 85°C; Packaging: Rail/Tube; Number of Pins: 14; Case/Package: SOIC; Width: 3.9mm; Length: 8.65mm; Unity Gain Bandwidth Product: 1MHz; Gain Bandwidth Product: 1MHz; Input Offset Voltage (Vos): 4.5mV; Package Quantity: 57; Number of Circuits: 4; Min Operating Temperature: -40°C; Nominal Supply Current: 100uA; Height: 1.25mm; Slew Rate: 0.6V/µs; Mount: Surface Mount
VR2 = CMP-2000-05078-1: 10K ohm Variable Resistor-Trimpot 3296 Package; Brand: Bourns; Power Rating: 500mW(1/2W); Unit Weight: 0.035000oz; Qualification: Commercial; Element Type: Cermet; Resistance: 10kOhms; Tolerance: 10%; Temperature Coefficient: 100PPM/C; Voltage Rating: 300V; Adjustment: TopCrossed; Product: Multiturn; Datasheet Version: Sep-04; Datasheet URL: https://datasheet.ciiva.com/19482/769696-19482212.pdf; RoHS: True; Tradename: Trimpot; Product Type: SquareTrimmingPotentiometer; Mounting: PanelMount; Packaging: Tube; Package Reference: 3299W; Operating Temperature Range: -55Cto+125C; Length: 10.03mm; Termination Style: Pin; Manufacturer: Bourns; Manufacturer URL: http://www.bourns.com/; Product Category: TrimmerResistors-ThroughHole; Width: 9.53mm; Taper: Linear; Package Description: 3-Pin Surface Mount Device, Body 9.53 x 6.1 mm, Pitch 2.54 mm; Type: Trimmers; Series: 3299; Product URL: https://sharvielectronics.com/product/10k-ohm-variable-resistor-trimpot-3296-package/; Price per piece: 11.23; Datasheet: https://sharvielectronics.com/wp-content/uploads/2020/06/50K-ohm-Variable-Resistor-Trimpot-3296-Package.pdf

## Sheet Voltage_measurement.SchDoc
size A4; SheetNumber: 4; SheetTotal: 9; SPICEModelCacheGQXFUCOC: <root> / <DocumentId>GQXFUCOC</DocumentId> / <CacheFrame Number="0"> / <Model Name="mcp6001" Kind="CKT"> / <Text>.SUBCKT MCP6001 1 2 3 4 5 / *               | | | | | / *               | | | | Output / *               | | | Negative Supply / *               | | Positive Supply / *               | Inverting Input / *               Non-inverting Input / * / ******************************************************************************** / * Software License Agreement                                                   * / *                                                                              * / * The software supplied herewith by Microchip Technology Incorporated (the     * / * "Company") is intended and supplied to you, the Company's customer, for use  * / * soley and exclusively on Microchip products.                                 * / *                                                                              * / * The software is owned by the Company and/or its supplier, and is protected   * / * under applicable copyright laws. All rights are reserved. Any use in         * / * violation of the foregoing restrictions may subject the user to criminal     * / * sanctions under applicable laws, as well as to civil liability for the       * / * breach of the terms and conditions of this license.                          * / *                                                                              * / * THIS SOFTWARE IS PROVIDED IN AN "AS IS" CONDITION. NO WARRANTIES, WHETHER    * / * EXPRESS, IMPLIED OR STATUTORY, INCLUDING, BUT NOT LIMITED TO, IMPLIED        * / * WARRANTIES OF MERCHANTABILITY AND FITNESS FOR A PARTICULAR PURPOSE APPLY TO  * / * THIS SOFTWARE. THE COMPANY SHALL NOT, IN ANY CIRCUMSTANCES, BE LIABLE FOR    * / * SPECIAL, INCIDENTAL OR CONSEQUENTIAL DAMAGES, FOR ANY REASON WHATSOEVER.     * / ******************************************************************************** / * / * Macromodel for the MCP6001/2/4 op amp family: / *   MCP6001, MCP6001R, MCP6001U, MCP6002, MCP6004 / * / * Revision History: / *   REV A: 21-Jun-02, Created model / *   REV B: 16-Jul-02, Improved output stage / *   REV C: 03-Jan-03, Added MCP6001 / *   REV D: 19-Aug-06, Added over temperature, improved output stage, / *                     fixed overdrive recovery time / *   REV E: 27-Jul-07, Updated output impedance for better model stability w/cap load / *   REV F: 09-Jul-12, Added MCP6001R, MCP6001U / * / * Recommendations: / *   Use PSPICE (other simulators may require translation) / *   For a quick, effective design, use a combination of: data sheet / *     specs, bench testing, and simulations with this macromodel / *   For high impedance circuits, set GMIN=100F in .OPTIONS / * / * Supported: / *   Typical performance for temperature range (-40 to 125) degrees Celsius / *   DC, AC, Transient, and Noise analyses. / *   Most specs, including: offsets, DC PSRR, DC CMRR, input impedance, / *     open loop gain, voltage ranges, supply current, ... , etc. / *   Temperature effects for Ibias, Iquiescent, Iout short circuit / *   current, Vsat on both rails, Slew Rate vs. Temp and P.S. / * / * Not Supported: / *   Some Variation in specs vs. Power Supply Voltage / *   Monte Carlo (Vos, Ib), Process variation / *   Distortion (detailed non-linear behavior) / *   Behavior outside normal operating region / * / * Input Stage / V10  3 10 -500M / R10 10 11 6.90K / R11 10 12 6.90K / C11 11 12 0.2p / C12 1  0 6.00P / E12 71 14 POLY(4) 20 0 21 0 26 0 27 0   1.00M 20.1 20.1 1 1 / G12 1 0 62 0 1m / M12 11 14 15 15 NMI L=2.00U W=42.0U / M14 12  2 15 15 NMI L=2.00U W=42.0U / G14 2 0 62 0 1m / C14  2  0 6.00P / I15 15  4 50.0U / V16 16  4 -300M / GD16 16 1 TABLE {V(16,1)} ((-100,-1p)(0,0)(1m,1n)(2m,1m)(3m,1)) / V13  3 13 -300M / GD13 2 13 TABLE {V(2,13)} ((-100,-1p)(0,0)(1m,1n)(2m,1m)(3m,1)) / R70 1 0 20.6T / R71 2 0 20.6T / R72 1 2 20T / I80 1 2 0.5p / * / * Noise, PSRR, and CMRR / I20 21 20 423U / D20 20  0 DN1 / D21  0 21 DN1 / G26  0 26 POLY(1) 3 4   110U -49U / R26 26  0 1 / G27  0 27 POLY(2) 1 0 2 0   -440U 39.7U 39.7U / R27 27  0 1 / * / * Open Loop Gain, Slew Rate / G30  0 30 POLY(1) 12 11   0 1 / R30 30  0 1K / G31  0 31 POLY(1) 3 4 86 5.25 / R31 31  0 1 TC=2.8m / GD31 30 31 TABLE {V(30,31)} ((-11,-1)(-10,-10n)(0,0)(1m,1000)) / G32 32  0 POLY(1) 3 4 113.7 3.5 / R32 32  0 1 TC=2.65m / GD32 30 32 TABLE {V(30,32)} ((-1m,-1000)(0,0)(10,10n)(11,1)) / G33 0 33 30 0 1m / R33 33 0 1k / G34  0 34 33 0 425M / R34  34 0 1K / C34  34 0 74U / G37  0 37 34 0 1m / R37  37 0 1K / C37  37 0 41.6P / G38  0 38 37 0 1m / R38  39 0 1K / L38  38 39 100U / E38  35 0 38 0 1 / G35 33 0 TABLE {V(35,3)} ((-1,-1n)(0,0)(16,1n))(16.1,1)) / G36 33 0 TABLE {V(35,4)} ((-16.1,-1)((-16,-1n)(0,0)(1,1n)) / * / * Output Stage / R80 50 0 100MEG / G50 0 50 57 96 2 / R58 57  96 0.50 / R57 57  0 750 / C58  5  0 2.00P / G57  0 57 POLY(3) 3 0 4 0 35 0   0 0.67M 0.67M 1.5M / GD55 55 57 TABLE {V(55,57)} ((-2m,-1)(-1m,-1m)(0,0)(10,1n)) / GD56 57 56 TABLE {V(57,56)} ((-2m,-1)(-1m,-1m)(0,0)(10,1n)) / E55 55  0 POLY(2) 3 0 51 0 -0.7m 1 -40.0M / E56 56  0 POLY(2) 4 0 52 0 1.2m 1 -37.0M / R51 51 0 1k / R52 52 0 1k / GD51 50 51 TABLE {V(50,51)} ((-10,-1n)(0,0)(1m,1m)(2m,1)) / GD52 50 52 TABLE {V(50,52)} ((-2m,-1)(-1m,-1m)(0,0)(10,1n)) / G53  3  0 POLY(1) 51 0  -49U 1M / G54  0  4 POLY(1) 52 0  -49U -1M / * / * Current Limit / G99 96 5 99 0 1 / R98 0 98 1 TC=-2.8M,2.63U / G97 0 98 TABLE { V(96,5) } ((-11.0,-10.0M)(-1.00M,-9.9M)(0,0)(1.00M,9.9M)(11.0,10.0M)) / E97 99 0 VALUE { V(98)*((V(3)-V(4))*359M + 310M)} / D98 4 5 DESD / D99 5 3 DESD / * / * Temperature / Voltage Sensitive IQuiscent / R61 0 61 100 TC 3.11M 4.51U / G61 3 4 61 0 1 / G60 0 61 TABLE {V(3, 4)} / + ((0,0)(900M,0.0106U)(1.00,0.20U)(1.3,0.63U) / + (1.5,0.66U)(1.6,1.06U)(5.5,1.10U)) / * / * Temp Sensitive offset voltage / I73 0 70 DC 1uA / R74 0 70 1 TC=2 / E75 1 71 70 0 1 / * / * Temp Sensistive IBias / I62 0 62 DC 1uA / R62 0 62 REXP 58.2u / * Voltage on R62 used for G12, G14 in input stage / * / * Models / .MODEL NMI NMOS / .MODEL DESD  D   N=1 IS=1.00E-15 / .MODEL DL  D   N=1 IS=1F / .MODEL DN1 D   IS=1P KF=146E-18 AF=1 / .MODEL REXP RES TCE=10.1 / .ENDS MCP6001</Text> / </Model> / </CacheFrame> / </root>
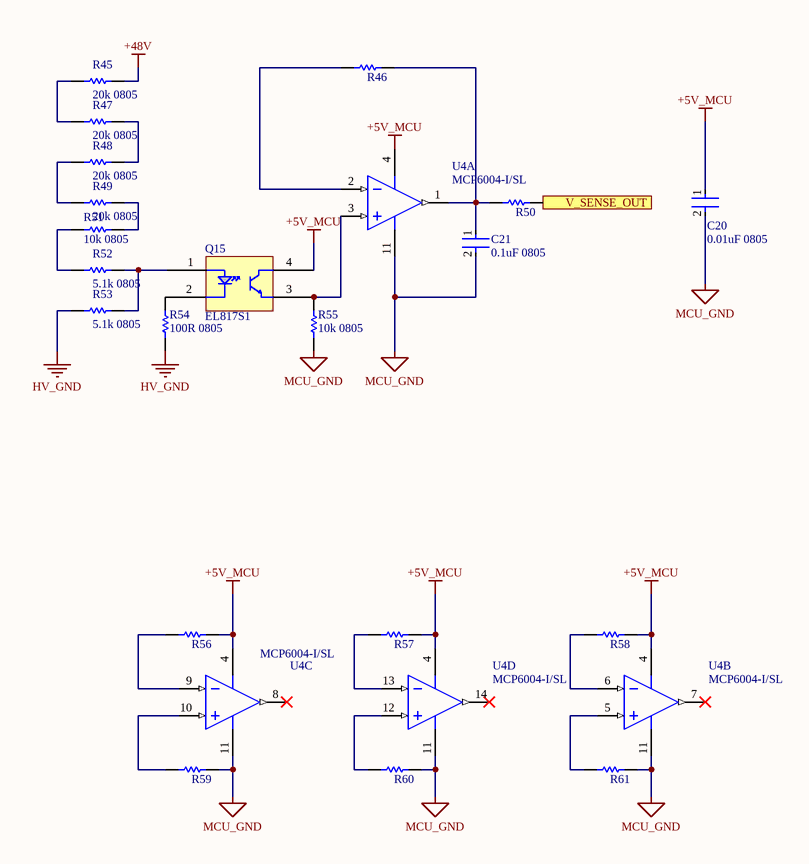
[diagram p3: Voltage_measurement.SchDoc]

### Parts
C20  0.01uF 0805  [R0805]
C21  0.1uF 0805  [R0805]
Q15  EL817S1  [EL817S1]
R45  20k 0805  [R0805]
R46  0R 0603  [R0603]  (value not drawn)
R47  20k 0805  [R0805]
R48  20k 0805  [R0805]
R49  20k 0805  [R0805]
R50  0R 0603  [R0603]  (value not drawn)
R51  10k 0805  [R0805]
R52  5.1k 0805  [R0805]
R53  5.1k 0805  [R0805]
R54  100R 0805  [R0805]
R55  10k 0805  [R0805]
R56  0R 0603  [R0603]  (value not drawn)
R57  0R 0603  [R0603]  (value not drawn)
R58  0R 0603  [R0603]  (value not drawn)
R59  0R 0603  [R0603]  (value not drawn)
R60  0R 0603  [R0603]  (value not drawn)
R61  0R 0603  [R0603]  (value not drawn)
U4  MCP6004-I/SL  [SOIC-SL14_M]  (parts A,B,C,D of 4)

### Ports
V_SENSE_OUT (out)

### Nets
+5V_MCU: C20.1 Q15.4(C) R56.1 R57.1 R58.1 U4.4(VDD)
+48V: R45.2
HV_GND: R53.1 R54.1
MCU_GND: C20.2 C21.2 R55.1 R59.1 R60.1 R61.1 U4.11(VSS)  [project net A_GND]
NetC21_1: C21.1 R46.1 R50.2 U4.1(VOUTA)
NetH8_43: R50.1 ; port V_SENSE_OUT
NetQ15_1: Q15.1(A) R52.2 R53.2
NetQ15_2: Q15.2(K) R54.2
NetQ15_3: Q15.3(E) R55.2 U4.3(VINA+)
NetR45_1: R45.1 R47.1
NetR46_2: R46.2 U4.2(VINA-)
NetR47_2: R47.2 R48.2
NetR48_1: R48.1 R49.1
NetR49_2: R49.2 R51.1
NetR51_2: R51.2 R52.1
NetR56_2: R56.2 U4.9(VINC-)
NetR57_2: R57.2 U4.13(VIND-)
NetR58_2: R58.2 U4.6(VINB-)
NetR59_2: R59.2 U4.10(VINC+)
NetR60_2: R60.2 U4.12(VIND+)
NetR61_2: R61.2 U4.5(VINB+)

Not connected (* = marked no-connect by the designer): U4 7(VOUTB)* 8(VOUTC)* 14(VOUTD)*

### Library data of the parts
C20 = 0.01uF 0805: as C10 on sheet Gate_Driver; Product URL: https://sharvielectronics.com/product/10nf-0-01uf-50v-capacitor-%c2%b110-tolerance-0805b103k500ct-0805-package/; Price per piece: 2.45; Datasheet: https://drive.google.com/file/d/18RHnvRuuuVekgJyOA4l8O3UUaSpuKbHR/view?usp=sharing
C21 = 0.1uF 0805: as C7 on sheet Gate_Driver; Product URL: https://sharvielectronics.com/product/0-1uf-100nf-100v-capacitor-%c2%b110-tolerance-cc0805kkx7r0bb104-0805-package/; Price per piece: 4.76; Datasheet: https://drive.google.com/file/d/1wr2K_YaGqgMtACeU2pC6RWLSxDMrIPxr/view?usp=sharing
Q15 = EL817S1: EL817S1 (B) (TU) – F Optocoupler SMD-4 Cut Tape; Product URL: https://sharvielectronics.com/product/el817s1-b-tu-f-optocoupler-smd-4-cut-tape/; Price per piece: 7.45; Datasheet: https://sharvielectronics.com/wp-content/uploads/2021/09/EL817-Optocoupler.pdf
R45 R47-R49 = R0805: as R36 on sheet Current_measurement; Price per piece: 1.15; Product URL: https://sharvielectronics.com/product/20k-ohm-1-8-watt-smd-resistor-1-tolerance-rc0805fr-0720kl-0805-package/; Datasheet: https://drive.google.com/file/d/1pkLQT_RQ1i35oFQcGREpZr7Oy3Ppi-ZT/view?usp=sharing
R46 R50 R56-R61 = R0000 0603: as R2 on sheet Gate_Driver; Price per piece: 0.97; Product URL: https://sharvielectronics.com/product/0-ohm-1-10-watt-resistor-1-tolerance-rc0603fr-070rl-0603-package/; Datasheet: https://drive.google.com/file/d/1pkLQT_RQ1i35oFQcGREpZr7Oy3Ppi-ZT/view?usp=sharing
R51 R55 = 10k 0805: as R6 on sheet HV_Side; Price per piece: 0.82; Product URL: https://sharvielectronics.com/product/10k-ohm-1-8-watt-resistor-1-tolerance-rc0805fr-0710kl-0805-package/; Datasheet: https://drive.google.com/file/d/1pkLQT_RQ1i35oFQcGREpZr7Oy3Ppi-ZT/view?usp=sharing
R52 R53 = R0805: 5.1K Ohm 1/8 Watt Resistor 1% Tolerance 0805S8F5101T5E – 0805 Package; Price per piece: 1.92; Product URL: https://sharvielectronics.com/product/5-1k-ohm-1-8-watt-resistor-1-tolerance-0805s8f5101t5e-0805-package/; Datasheet: https://drive.google.com/file/d/1rtx85iFJaMrDbsv7PAzG9bTFItPmAE38/view?usp=sharing
R54 = 100R 0805: 100 ohm 1/4W Resistor 0805 Package; Price per piece: 0.82; Product URL: https://sharvielectronics.com/product/100-ohm-1-4w-resistor-0805-package/; Datasheet: *
U4 = CMP-0187-00321-3: as U2 on sheet Current_measurement; RoHS Compliant: Yes; Technology: CMOS; Radiation Hardening: No; Bandwidth: 1MHz; Number of Elements: 4; REACH SVHC: No SVHC; Number of Amplifiers: 4; Lead Free: Lead Free; Contact Plating: Tin; Max Operating Temperature: 85°C; Packaging: Rail/Tube; Number of Pins: 14; Case/Package: SOIC; Width: 3.9mm; Length: 8.65mm; Unity Gain Bandwidth Product: 1MHz; Gain Bandwidth Product: 1MHz; Input Offset Voltage (Vos): 4.5mV; Package Quantity: 57; Number of Circuits: 4; Min Operating Temperature: -40°C; Nominal Supply Current: 100uA; Height: 1.25mm; Slew Rate: 0.6V/µs; Mount: Surface Mount; Product URL: https://sharvielectronics.com/product/mcp6004-1mhz-rail-to-rail-operational-amplifier-soic-14-package/; Datasheet: https://ww1.microchip.com/downloads/en/DeviceDoc/MCP6001-1R-1U-2-4-1-MHz-Low-Power-Op-Amp-DS20001733L.pdf; Price per piece: 38.45